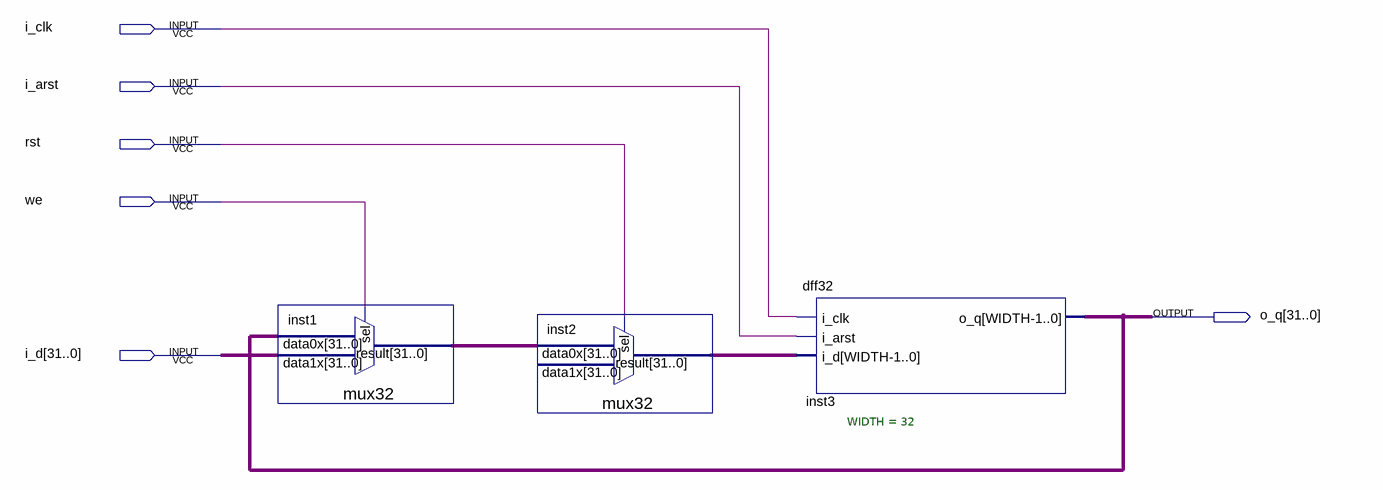
[diagram p0: schematic sheet]
// Quartus schematic Block1.bdf as structural Verilog: 3 symbols, 6 pins
module Block1 (
  input  i_clk,
  input  i_arst,
  input  rst,
  input  we,
  input  [31:0] i_d,
  output [31:0] o_q
);

  wire [31:0] inst1_result, inst2_result;

  mux32 inst1 (.data1x(i_d), .data0x(o_q), .sel(we), .result(inst1_result));
  mux32 inst2 (.data0x(inst1_result), .sel(rst), .result(inst2_result));  // open: data1x
  dff32 #(.WIDTH(32)) inst3 (.i_clk(i_clk), .i_arst(i_arst), .i_d(inst2_result), .o_q(o_q));
endmodule
